# EAGLE design xns-ip67 (EAGLE 7.7.0)
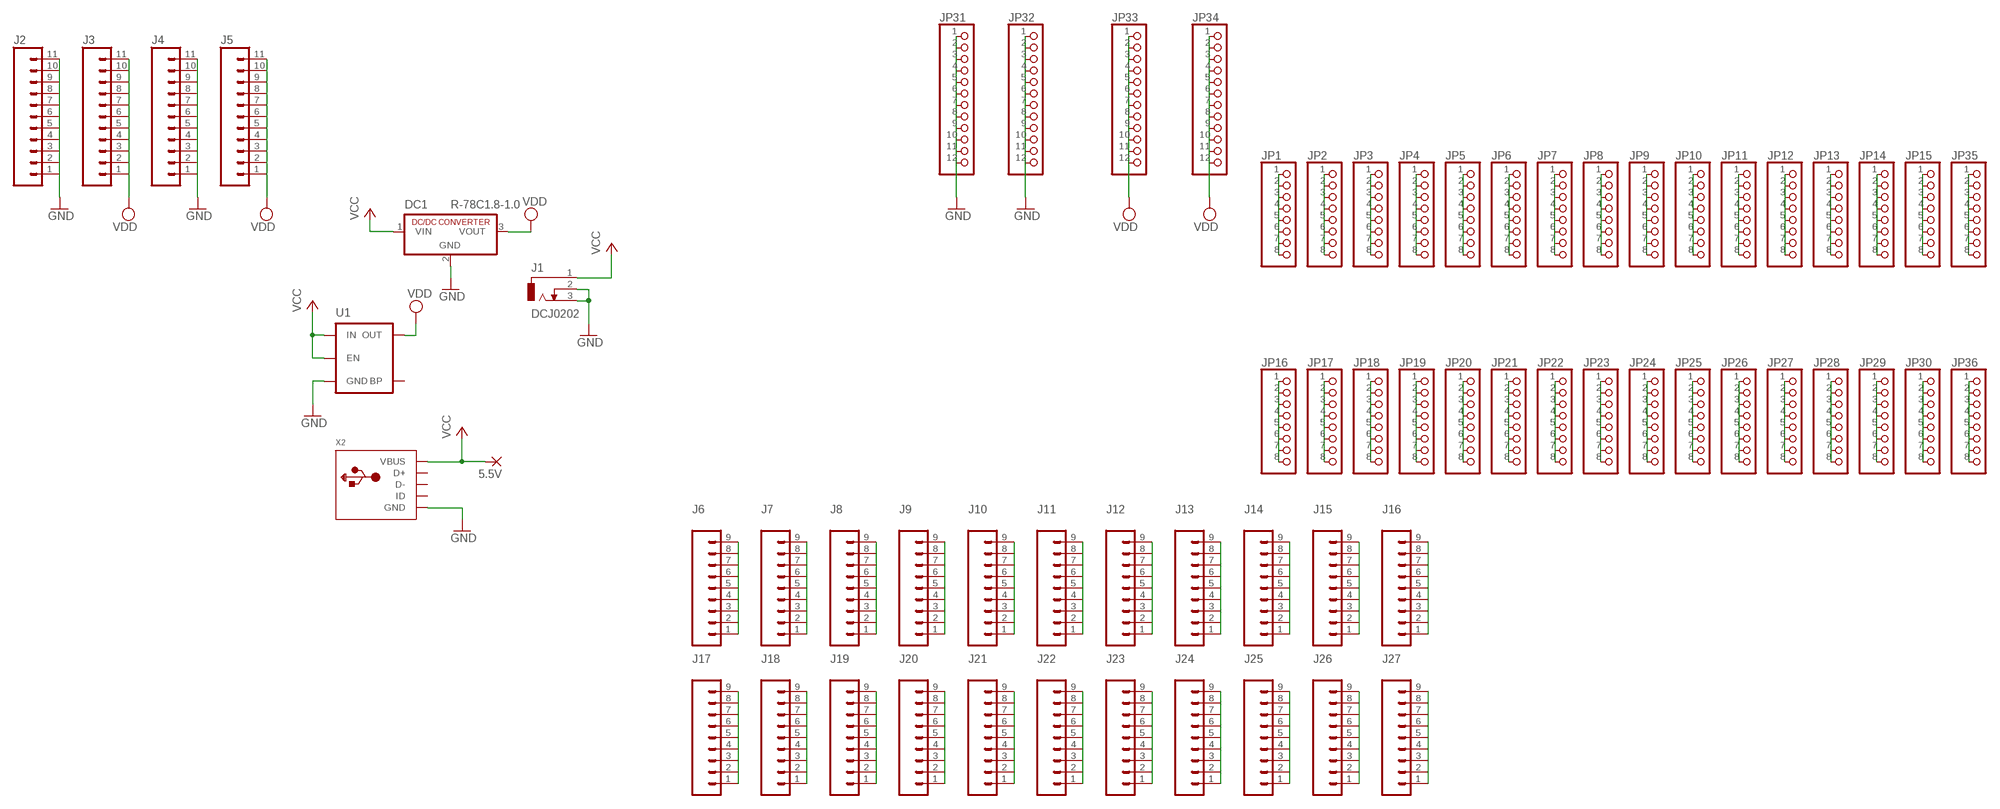
[diagram p0: schematic, sheet 1]

## Parts
5.5V  WIREPAD1,6/0,9  [1,6/0,9]
DC1  R-78C1.8-1.0  [SIP3]
J1  DCJ0202  [DCJ0202]
J2  M111X11_NO_SILK  [1X11_NO_SILK]
J3  M111X11_NO_SILK  [1X11_NO_SILK]
J4  M111X11_NO_SILK  [1X11_NO_SILK]
J5  M111X11_NO_SILK  [1X11_NO_SILK]
J6  M09NO_SILK  [1X09_NO_SILK]
J7  M09NO_SILK  [1X09_NO_SILK]
J8  M09NO_SILK  [1X09_NO_SILK]
J9  M09NO_SILK  [1X09_NO_SILK]
J10  M09NO_SILK  [1X09_NO_SILK]
J11  M09NO_SILK  [1X09_NO_SILK]
J12  M09NO_SILK  [1X09_NO_SILK]
J13  M09NO_SILK  [1X09_NO_SILK]
J14  M09NO_SILK  [1X09_NO_SILK]
J15  M09NO_SILK  [1X09_NO_SILK]
J16  M09NO_SILK  [1X09_NO_SILK]
J17  M09NO_SILK  [1X09_NO_SILK]
J18  M09NO_SILK  [1X09_NO_SILK]
J19  M09NO_SILK  [1X09_NO_SILK]
J20  M09NO_SILK  [1X09_NO_SILK]
J21  M09NO_SILK  [1X09_NO_SILK]
J22  M09NO_SILK  [1X09_NO_SILK]
J23  M09NO_SILK  [1X09_NO_SILK]
J24  M09NO_SILK  [1X09_NO_SILK]
J25  M09NO_SILK  [1X09_NO_SILK]
J26  M09NO_SILK  [1X09_NO_SILK]
J27  M09NO_SILK  [1X09_NO_SILK]
JP1  PINHD-1X8CLEANBIG  [1X08-CLEANBIG]
JP2  PINHD-1X8CLEANBIG  [1X08-CLEANBIG]
JP3  PINHD-1X8CLEANBIG  [1X08-CLEANBIG]
JP4  PINHD-1X8CLEANBIG  [1X08-CLEANBIG]
JP5  PINHD-1X8CLEANBIG  [1X08-CLEANBIG]
JP6  PINHD-1X8CLEANBIG  [1X08-CLEANBIG]
JP7  PINHD-1X8CLEANBIG  [1X08-CLEANBIG]
JP8  PINHD-1X8CLEANBIG  [1X08-CLEANBIG]
JP9  PINHD-1X8CLEANBIG  [1X08-CLEANBIG]
JP10  PINHD-1X8CLEANBIG  [1X08-CLEANBIG]
JP11  PINHD-1X8CLEANBIG  [1X08-CLEANBIG]
JP12  PINHD-1X8CLEANBIG  [1X08-CLEANBIG]
JP13  PINHD-1X8CLEANBIG  [1X08-CLEANBIG]
JP14  PINHD-1X8CLEANBIG  [1X08-CLEANBIG]
JP15  PINHD-1X8CLEANBIG  [1X08-CLEANBIG]
JP16  PINHD-1X8CLEANBIG  [1X08-CLEANBIG]
JP17  PINHD-1X8CLEANBIG  [1X08-CLEANBIG]
JP18  PINHD-1X8CLEANBIG  [1X08-CLEANBIG]
JP19  PINHD-1X8CLEANBIG  [1X08-CLEANBIG]
JP20  PINHD-1X8CLEANBIG  [1X08-CLEANBIG]
JP21  PINHD-1X8CLEANBIG  [1X08-CLEANBIG]
JP22  PINHD-1X8CLEANBIG  [1X08-CLEANBIG]
JP23  PINHD-1X8CLEANBIG  [1X08-CLEANBIG]
JP24  PINHD-1X8CLEANBIG  [1X08-CLEANBIG]
JP25  PINHD-1X8CLEANBIG  [1X08-CLEANBIG]
JP26  PINHD-1X8CLEANBIG  [1X08-CLEANBIG]
JP27  PINHD-1X8CLEANBIG  [1X08-CLEANBIG]
JP28  PINHD-1X8CLEANBIG  [1X08-CLEANBIG]
JP29  PINHD-1X8CLEANBIG  [1X08-CLEANBIG]
JP30  PINHD-1X8CLEANBIG  [1X08-CLEANBIG]
JP31  HEADER-1X12  [1X12_ROUND]
JP32  HEADER-1X12  [1X12_ROUND]
JP33  HEADER-1X12  [1X12_ROUND]
JP34  HEADER-1X12  [1X12_ROUND]
JP35  PINHD-1X8CLEANBIG  [1X08-CLEANBIG]
JP36  PINHD-1X8CLEANBIG  [1X08-CLEANBIG]
U1  MIC52053.3V  [SOT23-5]
X2  USBMICRO_20329  [4UCONN_20329]

## Nets
GND: DC1.2(GND) J1.2 J1.3 J2.1 J2.2 J2.3 J2.4 J2.5 J2.6 J2.7 J2.8 J2.9 J2.10 J2.11 J4.1 J4.2 J4.3 J4.4 J4.5 J4.6 J4.7 J4.8 J4.9 J4.10 J4.11 JP31.1 JP31.2 JP31.3 JP31.4 JP31.5 JP31.6 JP31.7 JP31.8 JP31.9 JP31.10 JP31.11 JP31.12 JP32.1 JP32.2 JP32.3 JP32.4 JP32.5 JP32.6 JP32.7 JP32.8 JP32.9 JP32.10 JP32.11 JP32.12 U1.2(GND) X2.BASE@1(GND) X2.BASE@2(GND) X2.GND X2.SPRT@1(GND) X2.SPRT@2(GND) X2.SPRT@3(GND) X2.SPRT@4(GND)
N$1: J6.1 J6.2 J6.3 J6.4 J6.5 J6.6 J6.7 J6.8 J6.9
N$2: J7.1 J7.2 J7.3 J7.4 J7.5 J7.6 J7.7 J7.8 J7.9
N$3: J8.1 J8.2 J8.3 J8.4 J8.5 J8.6 J8.7 J8.8 J8.9
N$4: J9.1 J9.2 J9.3 J9.4 J9.5 J9.6 J9.7 J9.8 J9.9
N$5: J10.1 J10.2 J10.3 J10.4 J10.5 J10.6 J10.7 J10.8 J10.9
N$6: J11.1 J11.2 J11.3 J11.4 J11.5 J11.6 J11.7 J11.8 J11.9
N$7: J12.1 J12.2 J12.3 J12.4 J12.5 J12.6 J12.7 J12.8 J12.9
N$8: J13.1 J13.2 J13.3 J13.4 J13.5 J13.6 J13.7 J13.8 J13.9
N$9: J14.1 J14.2 J14.3 J14.4 J14.5 J14.6 J14.7 J14.8 J14.9
N$10: J15.1 J15.2 J15.3 J15.4 J15.5 J15.6 J15.7 J15.8 J15.9
N$11: J16.1 J16.2 J16.3 J16.4 J16.5 J16.6 J16.7 J16.8 J16.9
N$12: J17.1 J17.2 J17.3 J17.4 J17.5 J17.6 J17.7 J17.8 J17.9
N$13: J18.1 J18.2 J18.3 J18.4 J18.5 J18.6 J18.7 J18.8 J18.9
N$14: J19.1 J19.2 J19.3 J19.4 J19.5 J19.6 J19.7 J19.8 J19.9
N$15: J20.1 J20.2 J20.3 J20.4 J20.5 J20.6 J20.7 J20.8 J20.9
N$16: J21.1 J21.2 J21.3 J21.4 J21.5 J21.6 J21.7 J21.8 J21.9
N$17: J22.1 J22.2 J22.3 J22.4 J22.5 J22.6 J22.7 J22.8 J22.9
N$18: J23.1 J23.2 J23.3 J23.4 J23.5 J23.6 J23.7 J23.8 J23.9
N$19: J24.1 J24.2 J24.3 J24.4 J24.5 J24.6 J24.7 J24.8 J24.9
N$20: J25.1 J25.2 J25.3 J25.4 J25.5 J25.6 J25.7 J25.8 J25.9
N$21: JP1.1 JP1.2 JP1.3 JP1.4 JP1.5 JP1.6 JP1.7 JP1.8
N$22: JP2.1 JP2.2 JP2.3 JP2.4 JP2.5 JP2.6 JP2.7 JP2.8
N$23: JP3.1 JP3.2 JP3.3 JP3.4 JP3.5 JP3.6 JP3.7 JP3.8
N$24: JP4.1 JP4.2 JP4.3 JP4.4 JP4.5 JP4.6 JP4.7 JP4.8
N$25: JP5.1 JP5.2 JP5.3 JP5.4 JP5.5 JP5.6 JP5.7 JP5.8
N$26: JP6.1 JP6.2 JP6.3 JP6.4 JP6.5 JP6.6 JP6.7 JP6.8
N$27: JP7.1 JP7.2 JP7.3 JP7.4 JP7.5 JP7.6 JP7.7 JP7.8
N$28: JP8.1 JP8.2 JP8.3 JP8.4 JP8.5 JP8.6 JP8.7 JP8.8
N$29: JP9.1 JP9.2 JP9.3 JP9.4 JP9.5 JP9.6 JP9.7 JP9.8
N$30: JP10.1 JP10.2 JP10.3 JP10.4 JP10.5 JP10.6 JP10.7 JP10.8
N$31: JP11.1 JP11.2 JP11.3 JP11.4 JP11.5 JP11.6 JP11.7 JP11.8
N$32: JP12.1 JP12.2 JP12.3 JP12.4 JP12.5 JP12.6 JP12.7 JP12.8
N$33: JP13.1 JP13.2 JP13.3 JP13.4 JP13.5 JP13.6 JP13.7 JP13.8
N$34: JP14.1 JP14.2 JP14.3 JP14.4 JP14.5 JP14.6 JP14.7 JP14.8
N$35: JP15.1 JP15.2 JP15.3 JP15.4 JP15.5 JP15.6 JP15.7 JP15.8
N$36: JP30.1 JP30.2 JP30.3 JP30.4 JP30.5 JP30.6 JP30.7 JP30.8
N$37: JP29.1 JP29.2 JP29.3 JP29.4 JP29.5 JP29.6 JP29.7 JP29.8
N$38: JP28.1 JP28.2 JP28.3 JP28.4 JP28.5 JP28.6 JP28.7 JP28.8
N$39: JP27.1 JP27.2 JP27.3 JP27.4 JP27.5 JP27.6 JP27.7 JP27.8
N$40: JP26.1 JP26.2 JP26.3 JP26.4 JP26.5 JP26.6 JP26.7 JP26.8
N$41: JP25.1 JP25.2 JP25.3 JP25.4 JP25.5 JP25.6 JP25.7 JP25.8
N$42: JP24.1 JP24.2 JP24.3 JP24.4 JP24.5 JP24.6 JP24.7 JP24.8
N$43: JP22.1 JP22.2 JP22.3 JP22.4 JP22.5 JP22.6 JP22.7 JP22.8
N$44: JP21.1 JP21.2 JP21.3 JP21.4 JP21.5 JP21.6 JP21.7 JP21.8
N$45: JP20.1 JP20.2 JP20.3 JP20.4 JP20.5 JP20.6 JP20.7 JP20.8
N$46: JP19.1 JP19.2 JP19.3 JP19.4 JP19.5 JP19.6 JP19.7 JP19.8
N$47: JP18.1 JP18.2 JP18.3 JP18.4 JP18.5 JP18.6 JP18.7 JP18.8
N$48: JP17.1 JP17.2 JP17.3 JP17.4 JP17.5 JP17.6 JP17.7 JP17.8
N$49: JP16.1 JP16.2 JP16.3 JP16.4 JP16.5 JP16.6 JP16.7 JP16.8
N$50: JP35.1 JP35.2 JP35.3 JP35.4 JP35.5 JP35.6 JP35.7 JP35.8
N$51: JP36.1 JP36.2 JP36.3 JP36.4 JP36.5 JP36.6 JP36.7 JP36.8
N$52: J26.1 J26.2 J26.3 J26.4 J26.5 J26.6 J26.7 J26.8 J26.9
N$53: J27.1 J27.2 J27.3 J27.4 J27.5 J27.6 J27.7 J27.8 J27.9
N$54: JP23.1 JP23.2 JP23.3 JP23.4 JP23.5 JP23.6 JP23.7 JP23.8
VCC: 5.5V.1(P) DC1.1(VIN) J1.1 U1.1(IN) U1.3(EN) X2.VBUS
VDD: DC1.3(VOUT) J3.1 J3.2 J3.3 J3.4 J3.5 J3.6 J3.7 J3.8 J3.9 J3.10 J3.11 J5.1 J5.2 J5.3 J5.4 J5.5 J5.6 J5.7 J5.8 J5.9 J5.10 J5.11 JP33.1 JP33.2 JP33.3 JP33.4 JP33.5 JP33.6 JP33.7 JP33.8 JP33.9 JP33.10 JP33.11 JP33.12 JP34.1 JP34.2 JP34.3 JP34.4 JP34.5 JP34.6 JP34.7 JP34.8 JP34.9 JP34.10 JP34.11 JP34.12 U1.5(OUT)
Unconnected: U1.4(BP) X2.D+ X2.D- X2.ID

## Library data of the parts
5.5V = wirepad:WIREPAD: Wire PAD connect wire on PCB
DC1 = dc-dc-converter:R-78C*-1.0: INNOLINE DC/DC-Converter 1.0 AMP SIP3 Single Output Source: Data sheet <http://www.mikrocontroller.net/attachment/150645/157764-da-01-en-DC_DC_WANDLER_R_78C5_0_1_0.pdf>
J1 = con-jack:DCJ0202: DC POWER JACK Source: DCJ0202.pdf; OC_FARNELL: unknown; OC_NEWARK: unknown
J2-J5 = SparkFun-Connectors:M11: Header 11 Standard 11-pin 0.1" header. Use with straight break away headers (SKU : PRT-00116), right angle break away headers (PRT-00553), swiss pins (PRT-00743), machine pins (PRT-00117), and female headers (PRT-00115).
J6-J27 = SparkFun-Connectors:M09: Header 9 Standard 9-pin 0.1" header. Use with straight break away headers (SKU : PRT-00116), right angle break away headers (PRT-00553), swiss pins (PRT-00743), machine pins (PRT-00117), and female headers (PRT-00115).
JP1-JP30 JP35 JP36 = adafruit:PINHD-1X8: PIN HEADER
JP31-JP34 = microbuilder:HEADER-1X12
U1 = SparkFun-PowerIC:MIC5205: MIC5205 150mA vreg 3.3V - VREG-00822 5V - VREG-00823; PROD_ID: VREG-00822
X2 = microbuilder:USB: USB Connectors USBMINIB - Surface Mount Female Mini-B USB Connector 4UConnector: 06564

## Net classes
0 default: width 0.508 mm, drill 0.508 mm, clearance 0.254 mm

## Board
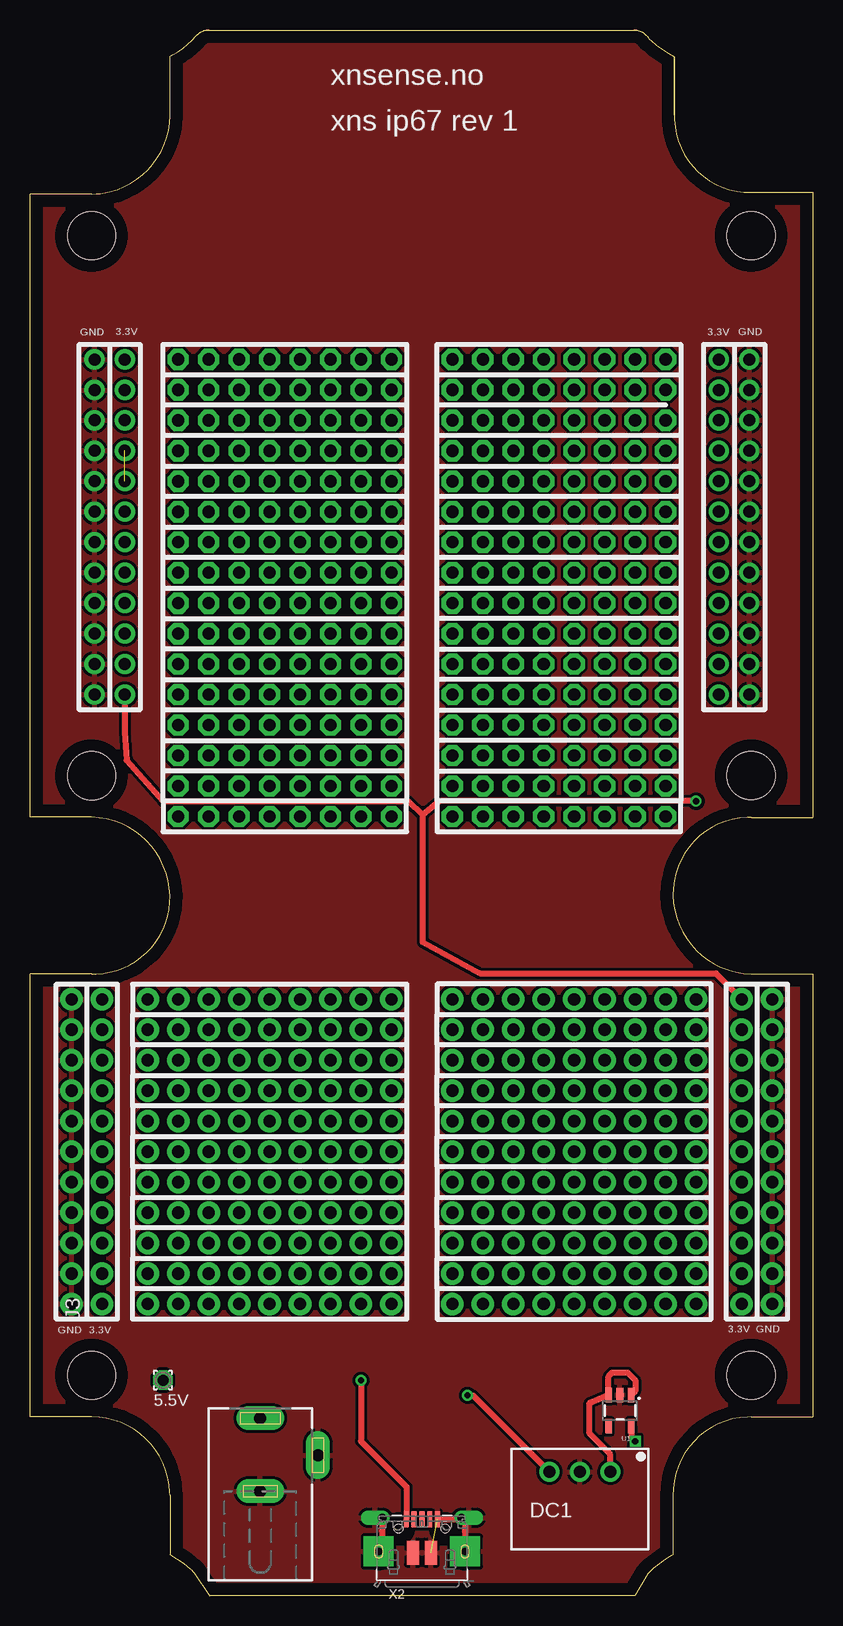
[diagram p1: board, top side]
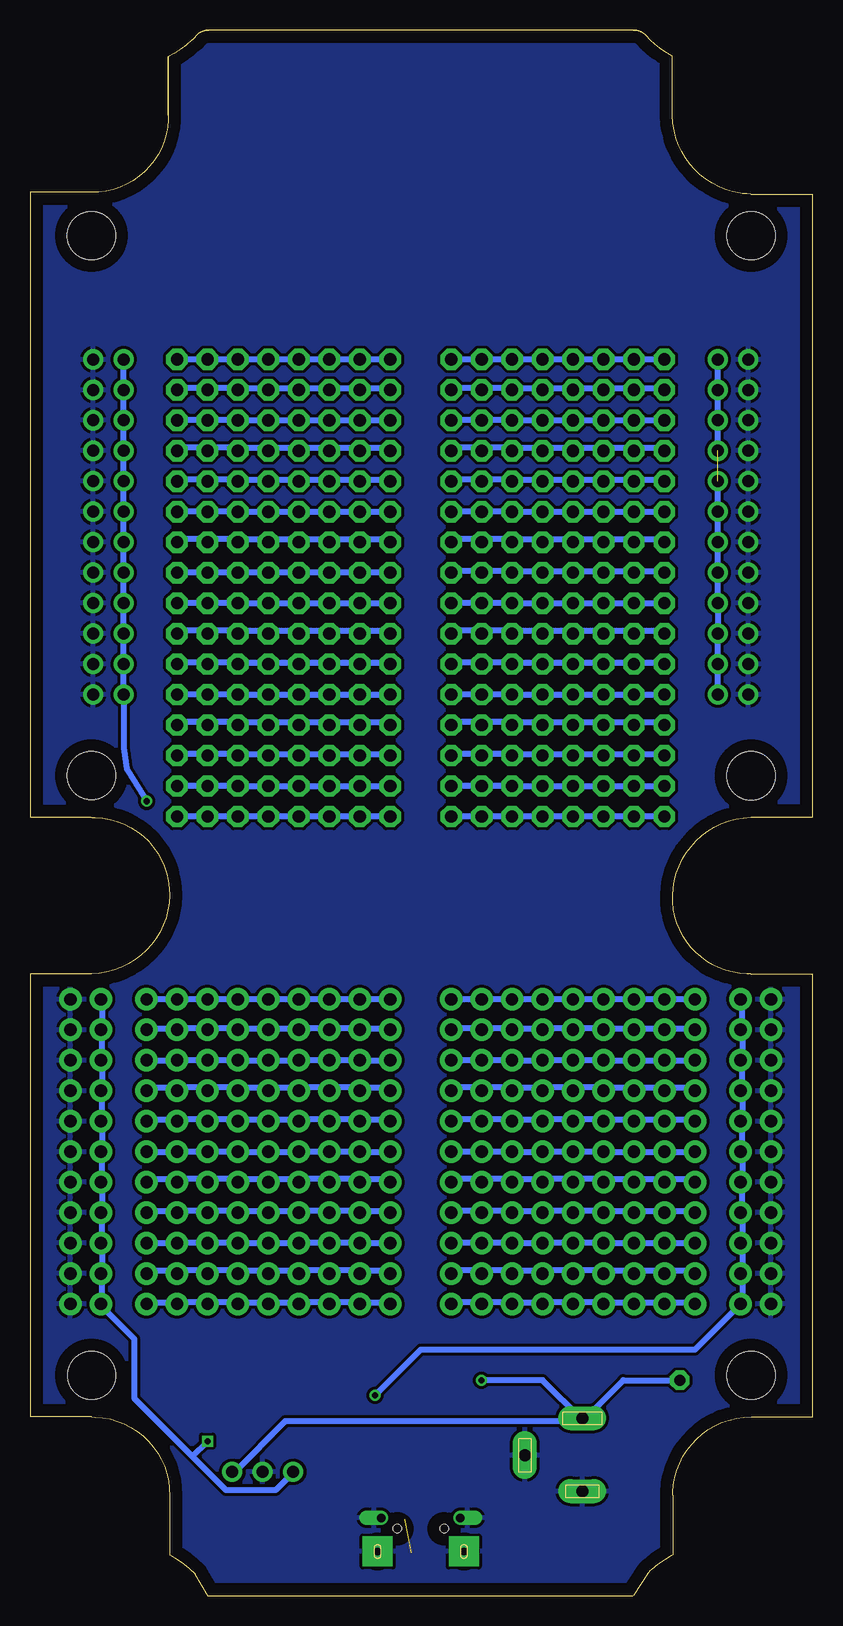
[diagram p2: board, bottom side, seen from below]

Size 65.26 x 130.53 mm. Coordinates in mm from the lower left corner, seen from the top.
Outline: 13.87,130.05 arc-48 14.94,130.53 50.35,130.53
Outline: 51.42,130.05 arc48 50.35,130.53
Outline: 53.72,123.44 53.72,128.3
Outline: 50.34,130.53 50.36,130.53 arc-41 51.27,130.19 arc-10 51.55,129.9 arc10 51.78,129.66 arc13 53.73,128.29 53.73,123.55 arc2 53.74,123.05 arc88 60.13,116.99 65.26,116.99 65.26,64.9 60.14,64.9
Outline: 60.13,64.9 59.81,64.89 arc89 53.62,58.39 arc88 60.13,51.86 65.26,51.86 65.26,14.91 60.13,14.91 59.82,14.9 arc89 53.62,8.36 53.62,3.44 53.53,3.39 arc17 51.51,1.84
Outline: 50.42,0 14.98,0
Outline: 13.73,1.87 arc11 13.39,2.23 arc10 11.68,3.42
Outline: 11.67,3.43 11.67,8.38 11.66,8.64 arc88 5.13,14.92 0,14.92 0,51.85 5.14,51.85 5.5,51.86 arc90 11.67,58.39 arc87 5.14,64.91 0.01,64.91 0.01,116.86 5.14,116.86 5.5,116.87 arc7 6.05,116.92 arc80 11.68,123.38 11.68,128.33 11.91,128.46 arc19 13.87,130.04 arc-47 14.93,130.53 50.33,130.53
Outline: 13.69,1.92 14.96,0.01
Outline: 51.51,1.85 50.44,0
Copper layers (1*16): Top 0.035mm / dielectric 1.5mm / Bottom 0.035mm
Design rules "default *": minimum track width 0.5mm, minimum drill 20mil, track to track 8mil, track to pad 8mil, pad to pad 8mil, via to via 8mil, smd to smd 8mil, copper to edge 40mil, drill to drill 8mil, minimum pad ring 10mil, minimum via ring 8mil, stop-mask expansion 4mil, vias tented up to drill 0mil, thermal gap 10mil
Holes 4 mm at 5.14,113.38 60.13,113.39 5.14,68.37 60.13,68.38 5.14,18.39 60.12,18.39

### Footprints (pad centres in the part's own frame; a part is rotated, then mirrored left to right if it is on the bottom)
1,6/0,9 = drill 0.914 pad 1.6 octagon: 1 0,0
SIP3 = drill 1 pad 1.676: 1 -2.54,0; 2 0,0; 3 2.54,0
DCJ0202 = drill 1 pad 2 long: 1 0,3.1; 2 4.8,0; 3 0,-3
1X11_NO_SILK = drill 1.016 pad 1.88: 1 0,0; 2 2.54,0; 3 5.08,0; 4 7.62,0; 5 10.16,0; 6 12.7,0; 7 15.24,0; 8 17.78,0; 9 20.32,0; 10 22.86,0; 11 25.4,0
1X09_NO_SILK = drill 1.016 pad 1.88: 1 0,0; 2 2.54,0; 3 5.08,0; 4 7.62,0; 5 10.16,0; 6 12.7,0; 7 15.24,0; 8 17.78,0; 9 20.32,0
1X08-CLEANBIG = drill 1.016 pad 1.778 octagon: 1 -8.89,0; 2 -6.35,0; 3 -3.81,0; 4 -1.27,0; 5 1.27,0; 6 3.81,0; 7 6.35,0; 8 8.89,0
1X12_ROUND = drill 1 pad 1.676: 1 -13.97,0; 2 -11.43,0; 3 -8.89,0; 4 -6.35,0; 5 -3.81,0; 6 -1.27,0; 7 1.27,0; 8 3.81,0; 9 6.35,0; 10 8.89,0; 11 11.43,0; 12 13.97,0
SOT23-5 = smd 0.55 x 1.2: 1 -0.95,-1.3; 2 0,-1.3; 3 0.95,-1.3; 4 0.95,1.3; 5 -0.95,1.3
4UCONN_20329 = smd 1 x 2: BASE@1 -0.75,-2; BASE@2 0.75,-2 | smd 0.4 x 1.35: D+ 0,0.775; D- -0.65,0.775; GND 1.3,0.775; ID 0.65,0.775; VBUS -1.3,0.775 | drill 0.7 offset: SPRT@1 -3.3,0.9; SPRT@2 3.3,0.9 | drill 0.6 pad 2.5 square: SPRT@3 -3.6,-1.9; SPRT@4 3.6,-1.9 | hole 0.7: -1.95,0; 1.95,0

### Placement (x,y rotation side)
5.5V  11.09,17.98 0 top
DC1  45.85,10.34 180 top
J1  19.2,11.72 0 top
J2  3.47,24.33 90 top
J3  6.01,24.33 90 top
J4  61.89,24.33 90 top
J5  59.35,24.33 90 top
J6  35.22,49.73 0 top
J7  35.22,47.19 0 top
J8  35.22,44.65 0 top
J9  35.22,42.11 0 top
J10  35.22,39.57 0 top
J11  35.22,37.03 0 top
J12  35.22,34.49 0 top
J13  35.22,31.95 0 top
J14  35.22,29.41 0 top
J15  35.22,26.87 0 top
J16  35.22,24.33 0 top
J17  9.82,49.73 0 top
J18  9.82,47.19 0 top
J19  9.82,44.65 0 top
J20  9.82,42.11 0 top
J21  9.82,39.57 0 top
J22  9.82,37.03 0 top
J23  9.82,34.49 0 top
J24  9.82,31.95 0 top
J25  9.82,29.41 0 top
J26  9.82,26.87 0 top
J27  9.82,24.33 0 top
JP1  21.25,103.07 0 top
JP2  21.25,100.53 0 top
JP3  21.25,97.99 0 top
JP4  21.25,95.45 0 top
JP5  21.25,92.91 0 top
JP6  21.25,90.37 0 top
JP7  21.25,87.83 0 top
JP8  21.25,85.29 0 top
JP9  21.25,82.75 0 top
JP10  21.25,80.21 0 top
JP11  21.25,77.67 0 top
JP12  21.25,75.13 0 top
JP13  21.25,72.59 0 top
JP14  21.25,70.05 0 top
JP15  21.25,67.51 0 top
JP16  44.11,67.51 0 top
JP17  44.11,70.05 0 top
JP18  44.11,72.59 0 top
JP19  44.11,75.13 0 top
JP20  44.11,77.67 0 top
JP21  44.11,80.21 0 top
JP22  44.11,82.75 0 top
JP23  44.11,85.29 0 top
JP24  44.11,87.83 0 top
JP25  44.11,90.37 0 top
JP26  44.11,92.91 0 top
JP27  44.11,95.45 0 top
JP28  44.11,97.99 0 top
JP29  44.11,100.53 0 top
JP30  44.11,103.07 0 top
JP31  5.38,89.1 90 top
JP32  59.98,89.1 90 top
JP33  57.44,89.1 90 top
JP34  7.91,89.1 90 top
JP35  21.25,64.97 0 top
JP36  44.11,64.97 0 top
U1  49.19,15.44 180 top
X2  32.68,5.6 0 top

### Tracks (layer width: path | path; a pad name or v marks a point on that pad's centre or on a via)
GND  (1 unrouted)
  Top 0.508: X2.SPRT@3 29.38,3.7 X2.SPRT@1 | X2.GND 35.98,6.38 X2.SPRT@2 36.28,6.5 X2.SPRT@4
  pour Bottom: -5.42,0.2 68.24,0.2 68.24,133.55 -5.42,133.55
  pour Top: -4.15,134.82 68.24,134.82 68.24,-1.07 -4.15,-1.07
N$1
  Bottom 0.508: J6.1 J6.2 J6.3 J6.4 J6.5 J6.6 J6.7 J6.8 J6.9
N$2
  Bottom 0.508: J7.1 35.22,47.32 37.51,47.32 J7.2 37.89,47.32 40.17,47.32 J7.3 40.55,47.32 42.84,47.32 | J7.9 55.41,47.32 53.13,47.32 J7.8 52.75,47.32 50.46,47.32 | 50.46,47.32 48.17,47.32 J7.6 47.79,47.32 45.51,47.32 J7.5 45.13,47.32 42.84,47.32 | 50.46,47.32 J7.7 | 42.84,47.32 J7.4
N$3
  Bottom 0.508: J8.1 J8.2 J8.3 J8.4 J8.5 J8.6 J8.7 J8.8 J8.9
N$4
  Bottom 0.508: J9.1 35.22,42.37 37.51,42.37 J9.2 37.89,42.37 40.17,42.37 J9.3 40.55,42.37 42.84,42.37 | J9.9 55.41,42.37 53.13,42.37 J9.8 52.75,42.37 50.46,42.37 | 50.46,42.37 48.17,42.37 J9.6 47.79,42.37 45.51,42.37 J9.5 45.13,42.37 42.84,42.37 | 50.46,42.37 J9.7 | 42.84,42.37 J9.4
N$5
  Bottom 0.508: J10.1 35.22,39.7 37.51,39.7 J10.2 37.89,39.7 40.17,39.7 J10.3 40.55,39.7 42.84,39.7 | J10.9 55.41,39.7 53.13,39.7 J10.8 52.75,39.7 50.46,39.7 | 50.46,39.7 48.17,39.7 J10.6 47.79,39.7 45.51,39.7 J10.5 45.13,39.7 42.84,39.7 | 50.46,39.7 J10.7 | 42.84,39.7 J10.4
N$6
  Bottom 0.508: J11.1 J11.2 J11.3 J11.4 J11.5 J11.6 J11.7 J11.8 J11.9
N$7
  Bottom 0.508: J12.1 35.22,34.75 37.51,34.75 J12.2 37.89,34.75 40.17,34.75 J12.3 40.55,34.75 42.84,34.75 | J12.9 55.41,34.75 53.13,34.75 J12.8 52.75,34.75 50.46,34.75 | 50.46,34.75 48.17,34.75 J12.6 47.79,34.75 45.51,34.75 J12.5 45.13,34.75 42.84,34.75 | 50.46,34.75 J12.7 | 42.84,34.75 J12.4
N$8
  Bottom 0.508: J13.1 35.22,32.08 37.51,32.08 J13.2 37.89,32.08 40.17,32.08 J13.3 40.55,32.08 42.84,32.08 | J13.9 55.41,32.08 53.13,32.08 J13.8 52.75,32.08 50.46,32.08 | 50.46,32.08 48.17,32.08 J13.6 47.79,32.08 45.51,32.08 J13.5 45.13,32.08 42.84,32.08 | 50.46,32.08 J13.7 | 42.84,32.08 J13.4
N$9
  Bottom 0.508: J14.1 J14.2 J14.3 J14.4 J14.5 J14.6 J14.7 J14.8 J14.9
N$10
  Bottom 0.508: J15.1 35.22,27.13 37.51,27.13 J15.2 37.89,27.13 40.17,27.13 J15.3 40.55,27.13 42.84,27.13 | J15.9 55.41,27.13 53.13,27.13 J15.8 52.75,27.13 50.46,27.13 | 50.46,27.13 48.17,27.13 J15.6 47.79,27.13 45.51,27.13 J15.5 45.13,27.13 42.84,27.13 | 50.46,27.13 J15.7 | 42.84,27.13 J15.4
N$11
  Bottom 0.508: J16.1 35.22,24.46 37.51,24.46 J16.2 37.89,24.46 40.17,24.46 J16.3 40.55,24.46 42.84,24.46 | J16.9 55.41,24.46 53.13,24.46 J16.8 52.75,24.46 50.46,24.46 | 50.46,24.46 48.17,24.46 J16.6 47.79,24.46 45.51,24.46 J16.5 45.13,24.46 42.84,24.46 | 50.46,24.46 J16.7 | 42.84,24.46 J16.4
N$12
  Bottom 0.508: J17.1 J17.2 J17.3 J17.4 J17.5 J17.6 J17.7 J17.8 J17.9
N$13
  Bottom 0.508: 27.6,47.32 25.31,47.32 J18.7 24.93,47.32 22.65,47.32 J18.6 22.27,47.32 19.98,47.32 | 27.6,47.32 29.89,47.32 J18.9 | 27.6,47.32 J18.8 | 12.36,47.32 10.07,47.32 J18.1 | 19.98,47.32 17.69,47.32 J18.4 17.31,47.32 15.03,47.32 J18.3 14.65,47.32 12.36,47.32 | 12.36,47.32 J18.2 | 19.98,47.32 J18.5
N$14
  Bottom 0.508: J19.9 J19.8 J19.7 J19.6 J19.5 J19.4 J19.3 J19.2 J19.1
N$15
  Bottom 0.508: 27.6,42.37 25.31,42.37 J20.7 24.93,42.37 22.65,42.37 J20.6 22.27,42.37 19.98,42.37 | 27.6,42.37 29.89,42.37 J20.9 | 27.6,42.37 J20.8 | 12.36,42.37 10.07,42.37 J20.1 | 19.98,42.37 17.69,42.37 J20.4 17.31,42.37 15.03,42.37 J20.3 14.65,42.37 12.36,42.37 | 12.36,42.37 J20.2 | 19.98,42.37 J20.5
N$16
  Bottom 0.508: 27.6,39.7 25.31,39.7 J21.7 24.93,39.7 22.65,39.7 J21.6 22.27,39.7 19.98,39.7 | 27.6,39.7 29.89,39.7 J21.9 | 27.6,39.7 J21.8 | 12.36,39.7 10.07,39.7 J21.1 | 19.98,39.7 17.69,39.7 J21.4 17.31,39.7 15.03,39.7 J21.3 14.65,39.7 12.36,39.7 | 12.36,39.7 J21.2 | 19.98,39.7 J21.5
N$17
  Bottom 0.508: J22.9 J22.8 J22.7 J22.6 J22.5 J22.4 J22.3 J22.2 J22.1
N$18
  Bottom 0.508: 27.6,34.75 25.31,34.75 J23.7 24.93,34.75 22.65,34.75 J23.6 22.27,34.75 19.98,34.75 | 27.6,34.75 29.89,34.75 J23.9 | 27.6,34.75 J23.8 | 12.36,34.75 10.07,34.75 J23.1 | 19.98,34.75 17.69,34.75 J23.4 17.31,34.75 15.03,34.75 J23.3 14.65,34.75 12.36,34.75 | 12.36,34.75 J23.2 | 19.98,34.75 J23.5
N$19
  Bottom 0.508: 27.6,32.08 25.31,32.08 J24.7 24.93,32.08 22.65,32.08 J24.6 22.27,32.08 19.98,32.08 | 27.6,32.08 29.89,32.08 J24.9 | 27.6,32.08 J24.8 | 12.36,32.08 10.07,32.08 J24.1 | 19.98,32.08 17.69,32.08 J24.4 17.31,32.08 15.03,32.08 J24.3 14.65,32.08 12.36,32.08 | 12.36,32.08 J24.2 | 19.98,32.08 J24.5
N$20
  Bottom 0.508: J25.9 J25.8 J25.7 J25.6 J25.5 J25.4 J25.3 J25.2 J25.1
N$21
  Bottom 0.508: JP1.1 JP1.2 JP1.3 JP1.4 JP1.5 JP1.6 JP1.7 JP1.8
N$22
  Bottom 0.508: JP2.1 12.36,100.66 14.65,100.66 JP2.2 15.03,100.66 17.31,100.66 JP2.3 17.69,100.66 19.98,100.66 | 27.6,100.66 25.31,100.66 JP2.6 24.93,100.66 22.65,100.66 JP2.5 22.27,100.66 19.98,100.66 | 27.6,100.66 29.89,100.66 JP2.8 | 27.6,100.66 JP2.7 | 19.98,100.66 JP2.4
N$23
  Bottom 0.508: JP3.1 JP3.2 JP3.3 JP3.4 JP3.5 JP3.6 JP3.7 JP3.8
N$24
  Bottom 0.508: JP4.1 12.36,95.71 14.65,95.71 JP4.2 15.03,95.71 17.31,95.71 JP4.3 17.69,95.71 19.98,95.71 | 27.6,95.71 25.31,95.71 JP4.6 24.93,95.71 22.65,95.71 JP4.5 22.27,95.71 19.98,95.71 | 27.6,95.71 29.89,95.71 JP4.8 | 27.6,95.71 JP4.7 | 19.98,95.71 JP4.4
N$25
  Bottom 0.508: JP5.1 12.36,93.04 14.65,93.04 JP5.2 15.03,93.04 17.31,93.04 JP5.3 17.69,93.04 19.98,93.04 | 27.6,93.04 25.31,93.04 JP5.6 24.93,93.04 22.65,93.04 JP5.5 22.27,93.04 19.98,93.04 | 27.6,93.04 29.89,93.04 JP5.8 | 27.6,93.04 JP5.7 | 19.98,93.04 JP5.4
N$26
  Bottom 0.508: JP6.1 JP6.2 JP6.3 JP6.4 JP6.5 JP6.6 JP6.7 JP6.8
N$27
  Bottom 0.508: JP7.1 12.36,88.09 14.65,88.09 JP7.2 15.03,88.09 17.31,88.09 JP7.3 17.69,88.09 19.98,88.09 | 27.6,88.09 25.31,88.09 JP7.6 24.93,88.09 22.65,88.09 JP7.5 22.27,88.09 19.98,88.09 | 27.6,88.09 29.89,88.09 JP7.8 | 27.6,88.09 JP7.7 | 19.98,88.09 JP7.4
N$28
  Bottom 0.508: JP8.1 12.36,85.42 14.65,85.42 JP8.2 15.03,85.42 17.31,85.42 JP8.3 17.69,85.42 19.98,85.42 | 27.6,85.42 25.31,85.42 JP8.6 24.93,85.42 22.65,85.42 JP8.5 22.27,85.42 19.98,85.42 | 27.6,85.42 29.89,85.42 JP8.8 | 27.6,85.42 JP8.7 | 19.98,85.42 JP8.4
N$29
  Bottom 0.508: JP9.1 JP9.2 JP9.3 JP9.4 JP9.5 JP9.6 JP9.7 JP9.8
N$30
  Bottom 0.508: JP10.1 12.36,80.47 14.65,80.47 JP10.2 15.03,80.47 17.31,80.47 JP10.3 17.69,80.47 19.98,80.47 | 27.6,80.47 25.31,80.47 JP10.6 24.93,80.47 22.65,80.47 JP10.5 22.27,80.47 19.98,80.47 | 27.6,80.47 29.89,80.47 JP10.8 | 27.6,80.47 JP10.7 | 19.98,80.47 JP10.4
N$31
  Bottom 0.508: JP11.1 12.36,77.8 14.65,77.8 JP11.2 15.03,77.8 17.31,77.8 JP11.3 17.69,77.8 19.98,77.8 | 27.6,77.8 25.31,77.8 JP11.6 24.93,77.8 22.65,77.8 JP11.5 22.27,77.8 19.98,77.8 | 27.6,77.8 29.89,77.8 JP11.8 | 27.6,77.8 JP11.7 | 19.98,77.8 JP11.4
N$32
  Bottom 0.508: JP12.1 JP12.2 JP12.3 JP12.4 JP12.5 JP12.6 JP12.7 JP12.8
N$33
  Bottom 0.508: JP13.1 12.36,72.85 14.65,72.85 JP13.2 15.03,72.85 17.31,72.85 JP13.3 17.69,72.85 19.98,72.85 | 27.6,72.85 25.31,72.85 JP13.6 24.93,72.85 22.65,72.85 JP13.5 22.27,72.85 19.98,72.85 | 27.6,72.85 29.89,72.85 JP13.8 | 27.6,72.85 JP13.7 | 19.98,72.85 JP13.4
N$34
  Bottom 0.508: JP14.1 12.36,70.18 14.65,70.18 JP14.2 15.03,70.18 17.31,70.18 JP14.3 17.69,70.18 19.98,70.18 | 27.6,70.18 25.31,70.18 JP14.6 24.93,70.18 22.65,70.18 JP14.5 22.27,70.18 19.98,70.18 | 27.6,70.18 29.89,70.18 JP14.8 | 27.6,70.18 JP14.7 | 19.98,70.18 JP14.4
N$35
  Bottom 0.508: JP15.1 JP15.2 JP15.3 JP15.4 JP15.5 JP15.6 JP15.7 JP15.8
N$36
  Bottom 0.508: JP30.1 JP30.2 JP30.3 JP30.4 JP30.5 JP30.6 JP30.7 JP30.8
N$37
  Bottom 0.508: JP29.1 35.22,100.66 37.51,100.66 JP29.2 37.89,100.66 40.17,100.66 JP29.3 40.55,100.66 42.84,100.66 | 50.46,100.66 48.17,100.66 JP29.6 47.79,100.66 45.51,100.66 JP29.5 45.13,100.66 42.84,100.66 | 50.46,100.66 52.75,100.66 JP29.8 | 50.46,100.66 JP29.7 | 42.84,100.66 JP29.4
N$38
  Bottom 0.508: JP28.1 JP28.2 JP28.3 JP28.4 JP28.5 JP28.6 JP28.7 JP28.8
N$39
  Bottom 0.508: JP27.1 35.22,95.71 37.51,95.71 JP27.2 37.89,95.71 40.17,95.71 JP27.3 40.55,95.71 42.84,95.71 | 50.46,95.71 48.17,95.71 JP27.6 47.79,95.71 45.51,95.71 JP27.5 45.13,95.71 42.84,95.71 | 50.46,95.71 52.75,95.71 JP27.8 | 50.46,95.71 JP27.7 | 42.84,95.71 JP27.4
N$40
  Bottom 0.508: JP26.1 35.22,93.04 37.51,93.04 JP26.2 37.89,93.04 40.17,93.04 JP26.3 40.55,93.04 42.84,93.04 | 50.46,93.04 48.17,93.04 JP26.6 47.79,93.04 45.51,93.04 JP26.5 45.13,93.04 42.84,93.04 | 50.46,93.04 52.75,93.04 JP26.8 | 50.46,93.04 JP26.7 | 42.84,93.04 JP26.4
N$41
  Bottom 0.508: JP25.1 JP25.2 JP25.3 JP25.4 JP25.5 JP25.6 JP25.7 JP25.8
N$42
  Bottom 0.508: JP24.1 35.22,88.09 37.51,88.09 JP24.2 37.89,88.09 40.17,88.09 JP24.3 40.55,88.09 42.84,88.09 | 50.46,88.09 48.17,88.09 JP24.6 47.79,88.09 45.51,88.09 JP24.5 45.13,88.09 42.84,88.09 | 50.46,88.09 52.75,88.09 JP24.8 | 50.46,88.09 JP24.7 | 42.84,88.09 JP24.4
N$43
  Bottom 0.508: JP22.1 JP22.2 JP22.3 JP22.4 JP22.5 JP22.6 JP22.7 JP22.8
N$44
  Bottom 0.508: JP21.1 35.22,80.47 37.51,80.47 JP21.2 37.89,80.47 40.17,80.47 JP21.3 40.55,80.47 42.84,80.47 | 50.46,80.47 48.17,80.47 JP21.6 47.79,80.47 45.51,80.47 JP21.5 45.13,80.47 42.84,80.47 | 50.46,80.47 52.75,80.47 JP21.8 | 50.46,80.47 JP21.7 | 42.84,80.47 JP21.4
N$45
  Bottom 0.508: JP20.1 35.22,77.8 37.51,77.8 JP20.2 37.89,77.8 40.17,77.8 JP20.3 40.55,77.8 42.84,77.8 | 50.46,77.8 48.17,77.8 JP20.6 47.79,77.8 45.51,77.8 JP20.5 45.13,77.8 42.84,77.8 | 50.46,77.8 52.75,77.8 JP20.8 | 50.46,77.8 JP20.7 | 42.84,77.8 JP20.4
N$46
  Bottom 0.508: JP19.1 JP19.2 JP19.3 JP19.4 JP19.5 JP19.6 JP19.7 JP19.8
N$47
  Bottom 0.508: JP18.1 35.22,72.85 37.51,72.85 JP18.2 37.89,72.85 40.17,72.85 JP18.3 40.55,72.85 42.84,72.85 | 50.46,72.85 48.17,72.85 JP18.6 47.79,72.85 45.51,72.85 JP18.5 45.13,72.85 42.84,72.85 | 50.46,72.85 52.75,72.85 JP18.8 | 50.46,72.85 JP18.7 | 42.84,72.85 JP18.4
N$48
  Bottom 0.508: JP17.1 35.22,70.18 37.51,70.18 JP17.2 37.89,70.18 40.17,70.18 JP17.3 40.55,70.18 42.84,70.18 | 50.46,70.18 48.17,70.18 JP17.6 47.79,70.18 45.51,70.18 JP17.5 45.13,70.18 42.84,70.18 | 50.46,70.18 52.75,70.18 JP17.8 | 50.46,70.18 JP17.7 | 42.84,70.18 JP17.4
N$49
  Bottom 0.508: JP16.1 JP16.2 JP16.3 JP16.4 JP16.5 JP16.6 JP16.7 JP16.8
N$50
  Bottom 0.508: JP35.1 JP35.2 JP35.3 JP35.4 JP35.5 JP35.6 JP35.7 JP35.8
N$51
  Bottom 0.508: JP36.1 JP36.2 JP36.3 JP36.4 JP36.5 JP36.6 JP36.7 JP36.8
N$52
  Bottom 0.508: 27.6,27.13 25.31,27.13 J26.7 24.93,27.13 22.65,27.13 J26.6 22.27,27.13 19.98,27.13 | 27.6,27.13 29.89,27.13 J26.9 | 27.6,27.13 J26.8 | 12.36,27.13 10.07,27.13 J26.1 | 19.98,27.13 17.69,27.13 J26.4 17.31,27.13 15.03,27.13 J26.3 14.65,27.13 12.36,27.13 | 12.36,27.13 J26.2 | 19.98,27.13 J26.5
N$53
  Bottom 0.508: 27.6,24.46 25.31,24.46 J27.7 24.93,24.46 22.65,24.46 J27.6 22.27,24.46 19.98,24.46 | 27.6,24.46 29.89,24.46 J27.9 | 27.6,24.46 J27.8 | 12.36,24.46 10.07,24.46 J27.1 | 19.98,24.46 17.69,24.46 J27.4 17.31,24.46 15.03,24.46 J27.3 14.65,24.46 12.36,24.46 | 12.36,24.46 J27.2 | 19.98,24.46 J27.5
N$54
  Bottom 0.508: JP23.1 JP23.2 JP23.3 JP23.4 JP23.5 JP23.6 JP23.7 JP23.8
VCC  (via drill 0.51)
  Top 0.508: v27.6,17.98 27.6,12.9 31.41,9.09 31.41,7.36 X2.VBUS | DC1.1 48.39,11.8 46.65,13.54 46.65,16.08 U1.3 48.24,18.3 48.55,18.62 49.83,18.62 50.46,17.98 50.46,17.06 U1.1
  Bottom 0.508: 5.5V.1 15.79,17.98 18.84,14.94 J1.1 19.22,14.55 | 19.22,14.55 43.98,14.55 48.17,10.36 DC1.1 | 19.22,14.55 19.22,14.68 22.52,17.98 v27.6,17.98
VDD  (via drill 0.51)  (1 unrouted)
  Top 0.508: U1.5 50.14,13.22 v50.46,12.9 | v36.49,16.71 36.94,16.71 DC1.3 | v55.54,66.24 34.14,66.24 32.72,65.11 | 32.72,65.11 32.74,63.7 32.74,54.5 37.51,51.89 57.19,51.89 J5.11 | JP34.1 7.91,71.96 8.04,69.67 11.09,66.24 31.54,66.24 32.72,65.11
  Bottom 0.508: 5.88,44.65 5.88,46.94 J3.10 5.88,47.32 5.88,49.61 J3.11 | 5.88,37.03 5.88,34.75 J3.5 5.88,34.37 5.88,32.08 J3.4 5.88,31.7 5.88,29.41 | 5.88,29.41 5.88,27.13 J3.2 5.88,26.75 5.88,24.46 J3.1 9.82,20.52 32.68,20.52 v36.49,16.71 | 5.88,29.41 J3.3 | 5.88,37.03 5.88,39.32 J3.7 5.88,39.7 5.88,41.99 J3.8 5.88,42.37 5.88,44.65 | 5.88,37.03 J3.6 | 5.88,44.65 J3.9 | J5.11 59.22,49.61 59.22,47.32 J5.10 59.22,46.94 59.22,44.65 | 59.22,44.65 59.22,42.37 J5.8 59.22,41.99 59.22,39.7 J5.7 59.22,39.32 59.22,37.03 | 59.22,29.41 59.22,27.13 J5.2 59.22,26.75 59.22,24.46 J5.1 59.22,24.08 56.56,21.41 56.56,16.46 51.73,11.63 | 51.73,11.63 48.94,8.84 44.74,8.84 43.6,9.98 DC1.3 | 59.22,29.41 59.22,31.7 J5.4 59.22,32.08 59.22,34.37 J5.5 59.22,34.75 59.22,37.03 | 59.22,29.41 J5.3 | 59.22,37.03 J5.6 | 59.22,44.65 J5.9 | v50.46,12.9 51.73,11.63 | JP34.1 JP34.2 JP34.3 JP34.4 JP34.5 JP34.6 JP34.7 JP34.8 | JP34.9 JP34.10 JP34.11 JP34.12 | JP33.12 JP33.11 JP33.10 JP33.9 JP33.8 JP33.7 JP33.6 JP33.5 JP33.4 JP33.3 JP33.2 JP33.1 57.44,70.69 57.19,68.91 v55.54,66.24

### Text on the board
tNames: xnsense.no | xns ip67 rev 1 | GND | 3.3V | 3.3V | GND | GND | 3.3V | 3.3V | GND